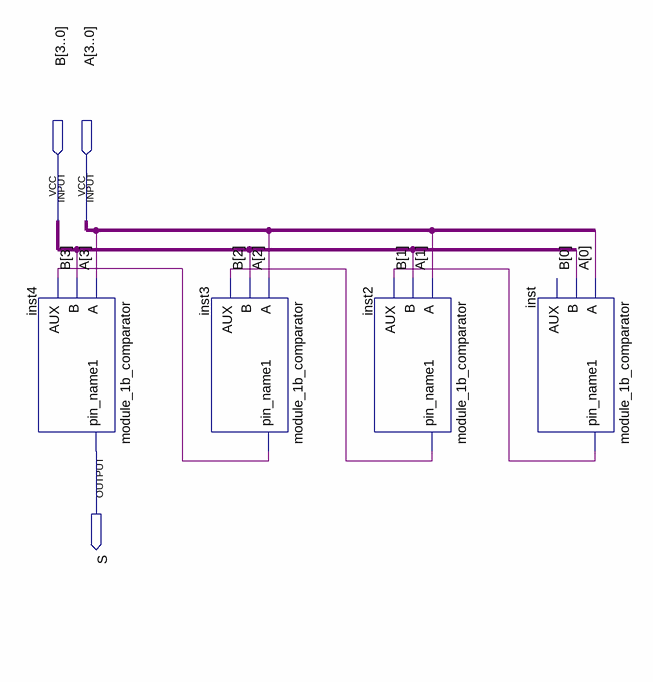
[diagram p0: schematic sheet]
// Quartus schematic module_4b_comparator.bdf as structural Verilog: 4 symbols, 3 pins
module module_4b_comparator (
  input  [3:0] B,
  input  [3:0] A,
  output S
);

  wire inst2_pin_name1, inst3_pin_name1, inst_pin_name1;

  module_1b_comparator inst4 (.A(A[3]), .B(B[3]), .AUX(inst3_pin_name1), .pin_name1(S));
  module_1b_comparator inst3 (.A(A[2]), .B(B[2]), .AUX(inst2_pin_name1), .pin_name1(inst3_pin_name1));
  module_1b_comparator inst2 (.A(A[1]), .B(B[1]), .AUX(inst_pin_name1), .pin_name1(inst2_pin_name1));
  module_1b_comparator inst (.A(A[0]), .B(B[0]), .pin_name1(inst_pin_name1));  // open: AUX
endmodule
